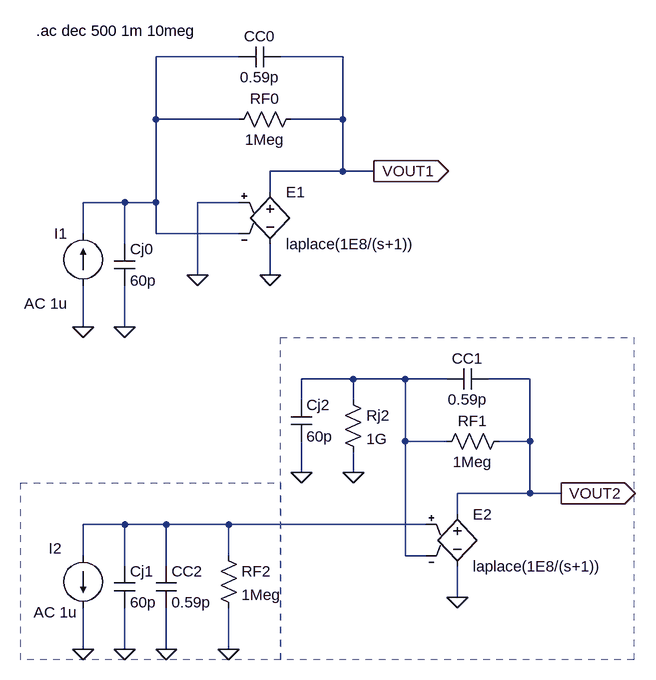
[diagram p0: schematic fig-03-03-23.asc]
fig-03-03-23.asc, the LTspice schematic file:
Version 4
SHEET 1 1496 692
WIRE 720 -240 592 -240
WIRE 880 -240 784 -240
WIRE 592 -144 592 -240
WIRE 720 -144 592 -144
WIRE 880 -144 880 -240
WIRE 880 -144 800 -144
WIRE 880 -64 880 -144
WIRE 880 -64 768 -64
WIRE 928 -64 880 -64
WIRE 768 -32 768 -64
WIRE 544 -16 480 -16
WIRE 592 -16 592 -144
WIRE 592 -16 544 -16
WIRE 720 -16 656 -16
WIRE 480 32 480 -16
WIRE 592 32 592 -16
WIRE 720 32 592 32
WIRE 544 48 544 -16
WIRE 656 96 656 -16
WIRE 768 96 768 48
WIRE 480 176 480 112
WIRE 544 176 544 112
WIRE 896 256 816 256
WIRE 976 256 896 256
WIRE 1040 256 976 256
WIRE 1168 256 1104 256
WIRE 816 288 816 256
WIRE 896 288 896 256
WIRE 976 352 976 256
WIRE 1040 352 976 352
WIRE 1168 352 1168 256
WIRE 1168 352 1120 352
WIRE 816 400 816 352
WIRE 896 400 896 368
WIRE 1168 432 1168 352
WIRE 1168 432 1056 432
WIRE 1216 432 1168 432
WIRE 1056 464 1056 432
WIRE 544 480 480 480
WIRE 608 480 544 480
WIRE 704 480 608 480
WIRE 1008 480 704 480
WIRE 480 528 480 480
WIRE 704 528 704 480
WIRE 976 528 976 352
WIRE 1008 528 976 528
WIRE 544 544 544 480
WIRE 608 544 608 480
WIRE 1056 592 1056 544
WIRE 480 672 480 608
WIRE 544 672 544 608
WIRE 608 672 608 608
WIRE 704 672 704 608
FLAG 480 176 0
FLAG 928 -64 VOUT1
IOPIN 928 -64 Out
FLAG 544 176 0
FLAG 768 96 0
FLAG 656 96 0
FLAG 480 672 0
FLAG 1216 432 VOUT2
IOPIN 1216 432 Out
FLAG 544 672 0
FLAG 1056 592 0
FLAG 816 400 0
FLAG 896 400 0
FLAG 608 672 0
FLAG 704 672 0
SYMBOL res 816 -160 R90
WINDOW 0 0 56 VBottom 2
WINDOW 3 32 56 VTop 2
SYMATTR InstName RF0
SYMATTR Value 1Meg
SYMBOL cap 528 48 R0
SYMATTR InstName Cj0
SYMATTR Value 60p
SYMBOL current 480 112 R180
WINDOW 0 24 80 Left 2
WINDOW 3 24 0 Left 2
WINDOW 123 24 -28 Left 2
WINDOW 39 0 0 Left 0
SYMATTR InstName I1
SYMATTR Value ""
SYMATTR Value2 AC 1u
SYMBOL cap 784 -256 R90
WINDOW 0 0 32 VBottom 2
WINDOW 3 32 32 VTop 2
SYMATTR InstName CC0
SYMATTR Value 0.59p
SYMBOL e 768 -48 R0
SYMATTR InstName E1
SYMATTR Value laplace(1E8/(s+1))
SYMBOL res 1136 336 R90
WINDOW 0 0 56 VBottom 2
WINDOW 3 32 56 VTop 2
SYMATTR InstName RF1
SYMATTR Value 1Meg
SYMBOL cap 528 544 R0
SYMATTR InstName Cj1
SYMATTR Value 60p
SYMBOL current 480 528 R0
WINDOW 0 -53 -11 Left 2
WINDOW 3 24 0 Left 2
WINDOW 123 -76 87 Left 2
WINDOW 39 0 0 Left 0
SYMATTR InstName I2
SYMATTR Value ""
SYMATTR Value2 AC 1u
SYMBOL cap 1104 240 R90
WINDOW 0 0 32 VBottom 2
WINDOW 3 32 32 VTop 2
SYMATTR InstName CC1
SYMATTR Value 0.59p
SYMBOL e 1056 448 R0
SYMATTR InstName E2
SYMATTR Value laplace(1E8/(s+1))
SYMBOL cap 800 288 R0
SYMATTR InstName Cj2
SYMATTR Value 60p
SYMBOL res 880 272 R0
SYMATTR InstName Rj2
SYMATTR Value 1G
SYMBOL res 688 512 R0
SYMATTR InstName RF2
SYMATTR Value 1Meg
SYMBOL cap 592 544 R0
SYMATTR InstName CC2
SYMATTR Value 0.59p
TEXT 408 -280 Left 2 !.ac dec 500 1m 10meg
RECTANGLE Normal 784 688 384 416 2
RECTANGLE Normal 1328 688 784 192 2

The netlist it stands for:
* fig-03-03-23.asc
RF0 VOUT1 N001 1Meg
Cj0 N001 0 60p
I1 0 N001 AC 1u
CC0 VOUT1 N001 0.59p
E1 VOUT1 0 0 N001 laplace(1E8/(s+1))
RF1 VOUT2 N002 1Meg
Cj1 N003 0 60p
I2 N003 0 AC 1u
CC1 VOUT2 N002 0.59p
E2 VOUT2 0 N003 N002 laplace(1E8/(s+1))
Cj2 N002 0 60p
Rj2 N002 0 1G
RF2 N003 0 1Meg
CC2 N003 0 0.59p
.ac dec 500 1m 10meg
.backanno
.end